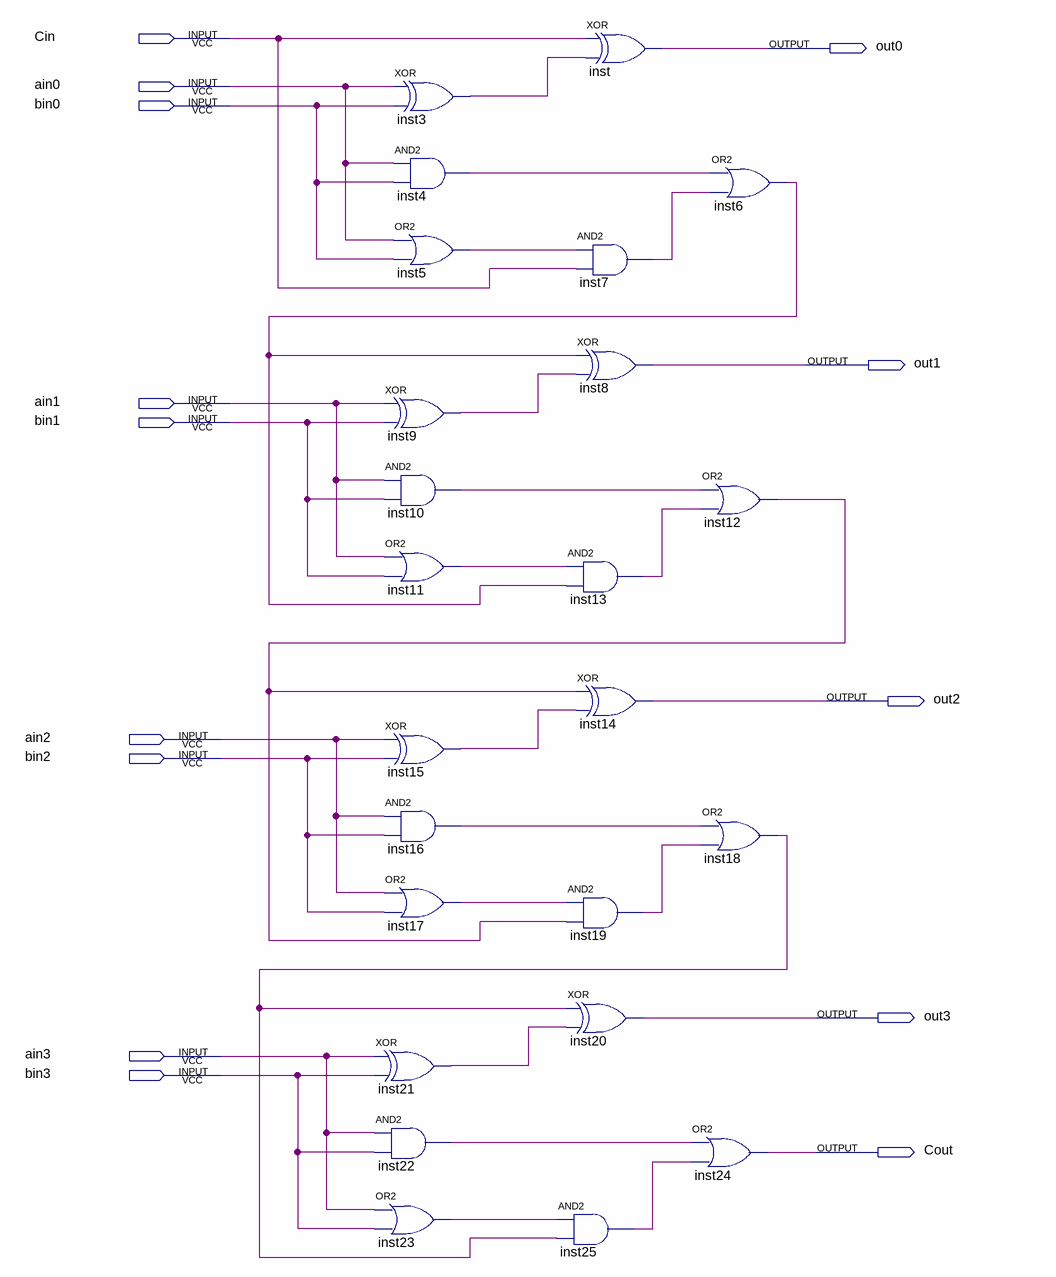
[diagram p0: schematic sheet]
// Quartus schematic Somador.bdf as structural Verilog: 24 symbols, 14 pins
module Somador (
  input  Cin,
  input  ain0,
  input  bin0,
  input  ain1,
  input  bin1,
  input  ain2,
  input  bin2,
  input  ain3,
  input  bin3,
  output out0,
  output out1,
  output out2,
  output out3,
  output Cout
);

  wire inst3_out, inst4_out, inst5_out, inst6_out, inst7_out, inst9_out, inst10_out, inst11_out, inst12_out,
       inst13_out, inst15_out, inst16_out, inst17_out, inst18_out, inst19_out, inst21_out, inst22_out,
       inst23_out, inst25_out;

  xor inst3 (inst3_out, ain0, bin0);
  and inst4 (inst4_out, ain0, bin0);
  or inst5 (inst5_out, ain0, bin0);
  xor inst9 (inst9_out, ain1, bin1);
  and inst10 (inst10_out, ain1, bin1);
  or inst11 (inst11_out, ain1, bin1);
  xor inst15 (inst15_out, ain2, bin2);
  and inst16 (inst16_out, ain2, bin2);
  or inst17 (inst17_out, ain2, bin2);
  xor inst21 (inst21_out, ain3, bin3);
  and inst22 (inst22_out, ain3, bin3);
  or inst23 (inst23_out, ain3, bin3);
  xor inst (out0, Cin, inst3_out);
  and inst7 (inst7_out, inst5_out, Cin);
  xor inst8 (out1, inst6_out, inst9_out);
  and inst13 (inst13_out, inst11_out, inst6_out);
  xor inst14 (out2, inst12_out, inst15_out);
  and inst19 (inst19_out, inst17_out, inst12_out);
  xor inst20 (out3, inst18_out, inst21_out);
  and inst25 (inst25_out, inst23_out, inst18_out);
  or inst6 (inst6_out, inst4_out, inst7_out);
  or inst12 (inst12_out, inst10_out, inst13_out);
  or inst18 (inst18_out, inst16_out, inst19_out);
  or inst24 (Cout, inst22_out, inst25_out);
endmodule
